# EAGLE design dirtcheaprx (EAGLE 6.4)
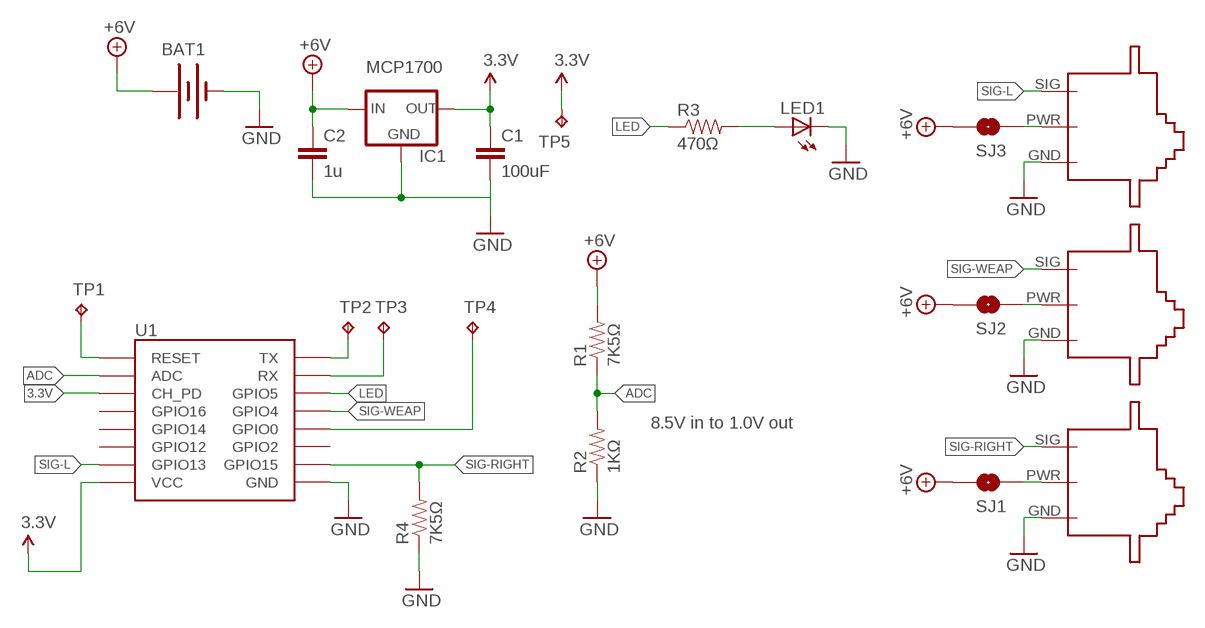
[diagram p0: schematic, sheet 1]

## Parts
BAT1  BATTERY-WIRE-CONN  [BATT-WIRE-CONN]
C1  100uF  CAP0603-CAP  [0603-CAP]
C2  1u  CAP0603-CAP  [0603-CAP]
IC1  MCP1700  V_REG_78XX-SOT  [SOT23-3]
LED1  LED5MM  [LED5MM]
R1  7K5Ω  RESISTOR0603-RES  [0603-RES]
R2  1KΩ  RESISTOR0603-RES  [0603-RES]
R3  470Ω  RESISTOR0603-RES  [0603-RES]
R4  7K5Ω  RESISTOR0603-RES  [0603-RES]
SERVO1  SERVO-1  [SERVO]
SERVO2  SERVO-1  [SERVO]
SERVO3  SERVO-1  [SERVO]
SJ1  SOLDERJUMPERNO  [SJ_2S-NO]
SJ2  SOLDERJUMPERNO  [SJ_2S-NO]
SJ3  SOLDERJUMPERNO  [SJ_2S-NO]
TP1  TPPAD1-13  [P1-13]
TP2  TPPAD1-13  [P1-13]
TP3  TPPAD1-13  [P1-13]
TP4  TPPAD1-13  [P1-13]
TP5  TPPAD1-13  [P1-13]
U1  ESP12SMD  [ESP12SE-SMD]

## Nets
3.3V: C1.1 IC1.2(OUT) TP5.TP U1.CH_PD U1.VCC
+6V: BAT1.POS(+) C2.1 IC1.3(IN) R1.2 SJ1.2 SJ2.2 SJ3.2
ADC: R1.1 R2.2 U1.ADC
GND: BAT1.NEG(-) C1.2 C2.2 IC1.1(GND) LED1.K(C) R2.1 R4.1 SERVO1.GND SERVO2.GND SERVO3.GND U1.GND
LED: R3.1 U1.GPIO5
N$1: LED1.A R3.2
N$2: SERVO1.PWR SJ1.1
N$3: SERVO2.PWR SJ2.1
N$4: SERVO3.PWR SJ3.1
N$8: TP1.TP U1.RESET
N$9: TP2.TP U1.TXD0(TX)
N$10: TP3.TP U1.RXD0(RX)
N$11: TP4.TP U1.GPIO0
SIG-L: SERVO3.SIG U1.GPIO13
SIG-RIGHT: R4.2 SERVO1.SIG U1.GPIO15
SIG-WEAP: SERVO2.SIG U1.GPIO4
Unconnected: U1.GPIO2 U1.GPIO12 U1.GPIO14 U1.GPIO16

## Notes on the sheet
- 8.5V in to 1.0V out

## Library data of the parts
BAT1 = dirtcheaprx:BATTERY: Battery Holders Various common sizes : AA, AAA, 20mm coin cell and 12mm coin cell.
C1 C2 = dirtcheaprx:CAP: Capacitor Standard 0603 ceramic capacitor, and 0.1" leaded capacitor.
IC1 = dirtcheaprx:V_REG_78XX: Voltage Regulator Standard 7805 5V regulator. IGO (Input Ground Output). Spark Fun Electronics SKU : COM-00107
LED1 = dirtcheaprx:LED: LEDs Standard schematic elements and footprints for 5mm, 3mm, 1206, and 0603 sized LEDs. 5mm - Spark Fun Electronics SKU : COM-00529 (and others)
R1-R4 = dirtcheaprx:RESISTOR: Resistor Basic schematic elements and footprints for 0603, 1206, and PTH resistors.
SERVO1-SERVO3 = dirtcheaprx:SERVO
SJ1-SJ3 = dirtcheaprx:SOLDERJUMPER: Solder Jumper Standard SMD solder jumper. Used to automate production. Two varients : Normally Open and Normally Closed are the same, but have different paste layers. NC will have a large amount of paste and should jumper during reflow.
TP1-TP5 = dirtcheaprx:TP: Test pad
U1 = dirtcheaprx:ESP12: ESP8266 Wifi module 12

## Board
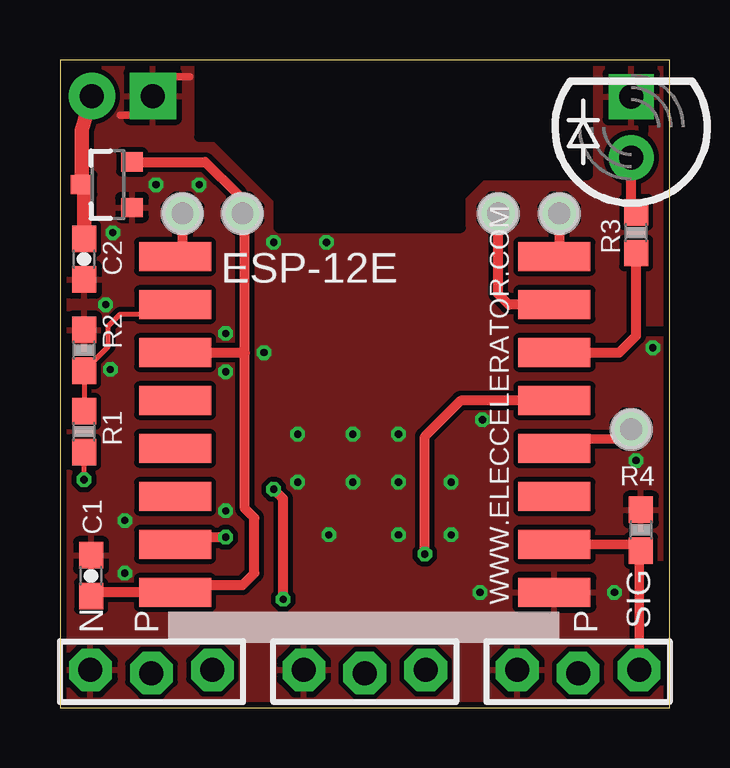
[diagram p1: board, top side]
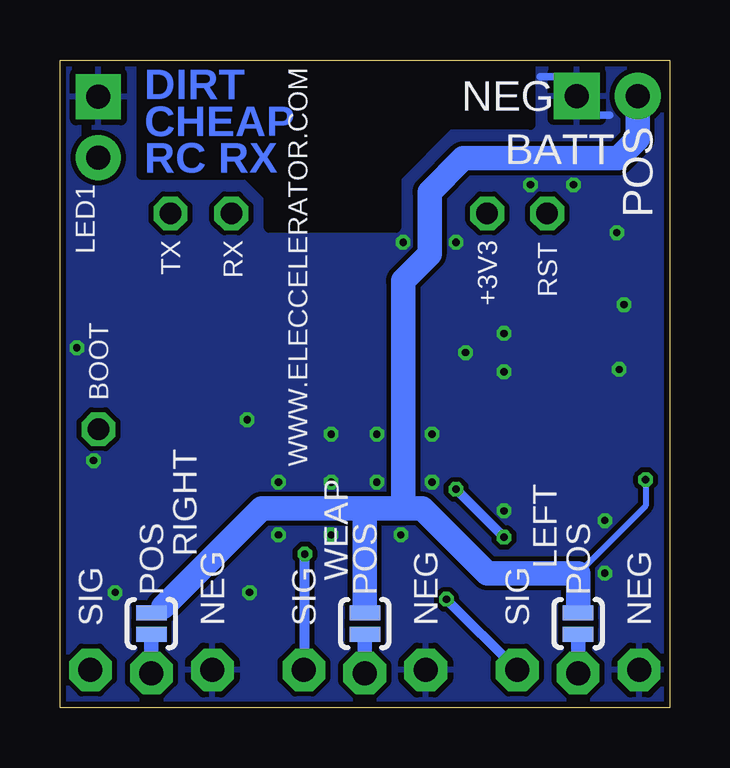
[diagram p2: board, bottom side, seen from below]

Size 25.4 x 27 mm. Coordinates in mm from the lower left corner, seen from the top.
Outline: 0,0 25.4,0 25.4,27 0,27 0,0
Copper layers (1*16): Top 0.035mm / dielectric 1.5mm / Bottom 0.035mm
Design rules "Fusion_eagle_rule_v1.1_TentedVias3": minimum track width 6mil, minimum drill 0.3mm, track to track 7mil, track to pad 7mil, pad to pad 7mil, via to via 7mil, smd to smd 0mil, copper to edge 10mil, drill to drill 10mil, minimum pad ring 10mil, minimum via ring 6mil, stop-mask expansion 2mil, vias tented up to drill 25mil, thermal gap 10mil
tRestrict: area 5.8,20 to 22,27; 3 lines
bRestrict: area 5.8,20 to 22,27; 1 lines

### Footprints (pad centres in the part's own frame; a part is rotated, then mirrored left to right if it is on the bottom)
BATT-WIRE-CONN = drill 1 pad 1.93 square: NEG 0,-1.27 | drill 1 pad 1.93: POS 0,1.27
0603-CAP = smd 1.1 x 1: 1 -0.85,0; 2 0.85,0
SOT23-3 = smd 0.8 x 0.9: 1 -0.95,-1; 2 0.95,-1; 3 0,1.1
LED5MM = drill 1 pad 1.88: A -1.27,0 | drill 1 pad 1.88 square: K 1.27,0
0603-RES = smd 1.1 x 1: 1 -0.85,0; 2 0.85,0
SERVO = drill 1 pad 1.778 octagon: GND -2.54,0.064; PWR 0,-0.064; SIG 2.54,0.064
SJ_2S-NO = smd 0.635 x 1.27: 1 -0.45,0; 2 0.45,0
P1-13 = drill 0.9 octagon: TP 0,0
ESP12SE-SMD = smd 3 x 1.2: ADC -7.9,3.6; CH_PD -7.9,1.6; GND 7.9,-8.4; GPIO0 7.9,-2.4; GPIO2 7.9,-4.4; GPIO4 7.9,-0.4; GPIO5 7.9,1.6; GPIO12 -7.9,-4.4; GPIO13 -7.9,-6.4; GPIO14 -7.9,-2.4; GPIO15 7.9,-6.4; GPIO16 -7.9,-0.4; RESET -7.9,5.6; RXD0 7.9,3.6; TXD0 7.9,5.6; VCC -7.9,-8.4

### Placement (x,y rotation side)
BAT1  2.6,25.5 90 top
C1  1.3,5.5 90 top
C2  1,18.7 270 top
IC1  2,21.8 90 top
LED1  23.8,24.2 90 top
R1  1,11.5 270 top
R2  1,14.9 270 top
R3  24,19.8 90 top
R4  24.2,7.4 270 top
SERVO1  21.59,1.5 0 top
SERVO2  12.7,1.5 0 top
SERVO3  3.81,1.5 0 top
SJ1  21.59,3.5 90 bottom
SJ2  12.7,3.5 90 bottom
SJ3  3.81,3.5 90 bottom
TP1  5.1,20.6 0 top
TP2  20.8,20.6 0 top
TP3  18.26,20.6 0 top
TP4  23.8,11.6 0 top
TP5  7.6,20.6 0 top
U1  12.7,13.2 0 top

### Tracks (layer width: path | path; a pad name or v marks a point on that pad's centre or on a via)
3.3V
  Top 0.406: IC1.2 6.05,22.75 7.4,21.4 7.4,20.6 TP5.TP 7.7,20.5 7.7,14.8 | 3.7,4.8 3.8,5.1 7.6,5.1 8.1,5.6 8.1,7.9 7.7,8.3 7.7,14.8 | U1.CH_PD 7.7,14.8 | U1.VCC 3.7,4.8 | 3.7,4.8 1.3,4.8 C1.1
+6V  (via drill 0.3)
  Top 0.203: v1,9.5 R1.2
  Top 0.61: BAT1.POS 0.9,24.07 IC1.3 1,21.7 C2.1
  Bottom 0.254: v1,9.5 1,8.41 3.81,5.6
  Bottom 0.406: SJ2.2 12.95,3.95 12.7,4.2
  Bottom 0.61: SJ1.2 21.35,3.95 21.1,4.2 | SJ3.2 4.15,3.95 3.81,4.2
  Bottom 1.016: BAT1.POS 1.33,23.72 2.15,22.9 8.6,22.9 10,21.5 10,18.9 11.1,17.8 11.1,8.3 | 11.1,8.3 10.3,8.3 7.6,5.6 3.81,5.6 3.81,4.2 | 12.7,4.2 12.7,8.3 | 12.7,8.3 11.1,8.3 | 21.1,4.2 17,8.3 12.7,8.3
ADC
  Top 0.203: R1.1 R2.2 2,15.05 2,15.9 2.5,16.4 4,16.4 U1.ADC
GND  (via drill 0.3)
  Top 0.305: 3.3,24.7 2.5,24.7 | 5.4,26.3 4.6,26.3
  Bottom 0.305: 2.5,24.7 3.3,24.7 | 4.6,26.3 5.4,26.3
  other vias: 1.9,16.8 2.7,7.8 2.1,14.1 6.9,15.6 6.9,14 8.5,14.8 4,21.8 5.8,21.8 2.2,19.8 8.9,19.4 11.1,19.4 24.7,15 23.1,4.8 6.9,8.2 9.9,9.4 11.2,7.2 12.2,9.4 14.1,7.2 14.1,9.4 16.3,9.4 16.3,7.2 2.7,5.6 17.5,4.8 9.9,11.4 12.2,11.4 14.1,11.4 17.6,12 24,10.3
  pour Top (isolate 0.203): 0,0 25.4,0 25.4,27 0,27
  pour Bottom (isolate 0.203): 0,0 25.4,0 25.4,27 0,27
LED
  Top 0.406: U1.GPIO5 23.29,14.8 24,15.51 R3.1
N$1
  Top 0.406: R3.2 23.8,20.85 LED1.A
N$2
  Bottom 0.61: SERVO1.PWR SJ1.1
N$3
  Bottom 0.61: SERVO2.PWR SJ2.1
N$4
  Bottom 0.61: SERVO3.PWR SJ3.1
N$8
  Top 0.406: TP1.TP 5.1,18.8 U1.RESET
N$9
  Top 0.406: TP2.TP 20.8,18.8 U1.TXD0
N$10
  Top 0.406: U1.RXD0 18.7,16.8 18.26,17.24 TP3.TP
N$11
  Top 0.39: U1.GPIO0 21.9,10.8 21.9,11.2 23.3,11.2 TP4.TP
SIG-L  (via drill 0.3)
  Top 0.406: 4.4,7.1 U1.GPIO13 3.8,6.8 3.9,7.1 v6.9,7.1 | v9.3,4.51 9.3,8.7 v8.9,9.1
  Bottom 0.406: v6.9,7.1 v8.9,9.1 | SERVO3.SIG v9.3,4.51
SIG-RIGHT
  Top 0.39: U1.GPIO15 24.1,6.8 R4.2 24.13,6.12 SERVO1.SIG
SIG-WEAP  (via drill 0.3)
  Top 0.406: U1.GPIO4 16.7,12.8 15.2,11.3 v15.2,6.4
  Bottom 0.406: SERVO2.SIG arc-90 15.2,1.6 v15.2,6.4

### Text on the board
Bottom: DIRT / CHEAP / RC RX
tPlace: WWW.ELECCELERATOR.COM | N | P | P | SIG
bPlace: WWW.ELECCELERATOR.COM | LEFT | RIGHT | WEAP
bNames: +3V3 | RX | TX | RST | BOOT
bStop: DIRT / CHEAP / RC RX